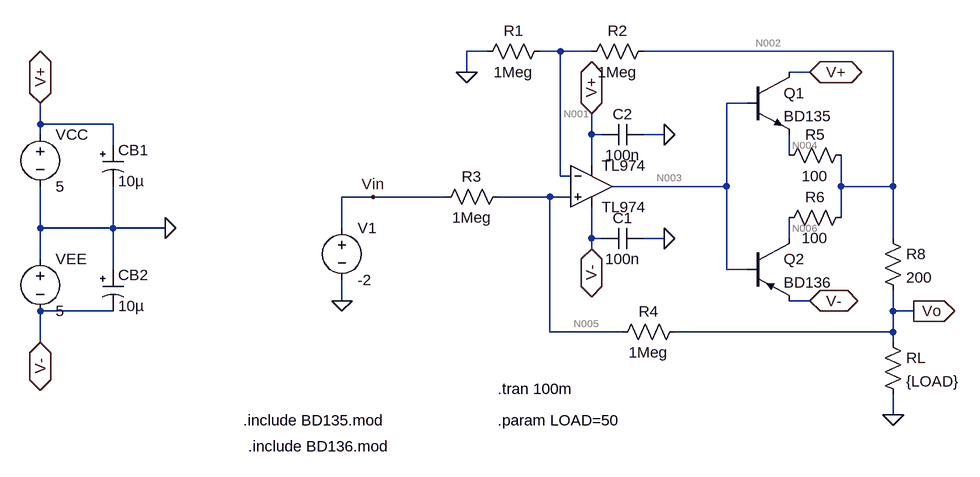
[diagram p0: schematic howlandCurrentPumpBoostedSourceCurrent.asc]
howlandCurrentPumpBoostedSourceCurrent.asc, the LTspice schematic file:
Version 4
SHEET 1 1564 680
WIRE 656 -192 624 -192
WIRE 768 -192 736 -192
WIRE 816 -192 768 -192
WIRE 1280 -192 896 -192
WIRE 624 -160 624 -192
WIRE 1152 -160 1120 -160
WIRE 1056 -112 1024 -112
WIRE -32 -80 -32 -112
WIRE 80 -80 -32 -80
WIRE -32 -64 -32 -80
WIRE 816 -64 816 -96
WIRE 832 -64 816 -64
WIRE 928 -64 896 -64
WIRE 80 -48 80 -80
WIRE 1120 -32 1120 -64
WIRE 816 -16 816 -64
WIRE 768 0 768 -192
WIRE 784 0 768 0
WIRE 1024 16 1024 -112
WIRE 1024 16 848 16
WIRE 1200 16 1200 -32
WIRE 1280 16 1280 -192
WIRE 1280 16 1200 16
WIRE 480 32 432 32
WIRE 592 32 480 32
WIRE 752 32 672 32
WIRE 784 32 752 32
WIRE 1200 64 1200 16
WIRE -32 80 -32 16
WIRE 80 80 80 16
WIRE 80 80 -32 80
WIRE 160 80 80 80
WIRE 432 80 432 32
WIRE 816 96 816 48
WIRE 832 96 816 96
WIRE 928 96 896 96
WIRE 1120 96 1120 64
WIRE 1280 96 1280 16
WIRE 816 112 816 96
WIRE -32 128 -32 80
WIRE 80 144 80 80
WIRE 1024 144 1024 16
WIRE 1056 144 1024 144
WIRE 432 192 432 160
WIRE 1152 192 1120 192
WIRE 80 208 -32 208
WIRE 1280 208 1280 176
WIRE 1312 208 1280 208
WIRE 752 240 752 32
WIRE 864 240 752 240
WIRE 1280 240 1280 208
WIRE 1280 240 944 240
WIRE -32 256 -32 208
WIRE 1280 256 1280 240
WIRE 1280 368 1280 336
FLAG 160 80 0
FLAG -32 -112 V+
IOPIN -32 -112 BiDir
FLAG -32 256 V-
IOPIN -32 256 BiDir
FLAG 928 -64 0
FLAG 928 96 0
FLAG 816 112 V-
IOPIN 816 112 BiDir
FLAG 816 -96 V+
IOPIN 816 -96 BiDir
FLAG 624 -160 0
FLAG 432 192 0
FLAG 480 32 Vin
FLAG 1280 368 0
FLAG 1152 -160 V+
IOPIN 1152 -160 BiDir
FLAG 1152 192 V-
IOPIN 1152 192 BiDir
FLAG 1312 208 Vo
IOPIN 1312 208 Out
SYMBOL voltage -32 -80 R0
WINDOW 123 0 0 Left 0
WINDOW 39 0 0 Left 0
SYMATTR InstName VCC
SYMATTR Value 5
SYMBOL voltage -32 112 R0
SYMATTR InstName VEE
SYMATTR Value 5
SYMBOL TL974 816 16 R0
SYMATTR InstName TL974
SYMBOL res 912 -208 R90
WINDOW 0 0 56 VBottom 2
WINDOW 3 32 56 VTop 2
SYMATTR InstName R2
SYMATTR Value 1Meg
SYMBOL cap 896 80 R90
WINDOW 0 0 32 VBottom 2
WINDOW 3 32 32 VTop 2
SYMATTR InstName C1
SYMATTR Value 100n
SYMBOL cap 896 -80 R90
WINDOW 0 0 32 VBottom 2
WINDOW 3 32 32 VTop 2
SYMATTR InstName C2
SYMATTR Value 100n
SYMBOL polcap 64 -48 R0
SYMATTR InstName CB1
SYMATTR Value 10µ
SYMBOL polcap 64 144 R0
SYMATTR InstName CB2
SYMATTR Value 10µ
SYMBOL res 752 -208 R90
WINDOW 0 0 56 VBottom 2
WINDOW 3 32 56 VTop 2
SYMATTR InstName R1
SYMATTR Value 1Meg
SYMBOL res 960 224 R90
WINDOW 0 0 56 VBottom 2
WINDOW 3 32 56 VTop 2
SYMATTR InstName R4
SYMATTR Value 1Meg
SYMBOL res 688 16 R90
WINDOW 0 0 56 VBottom 2
WINDOW 3 32 56 VTop 2
SYMATTR InstName R3
SYMATTR Value 1Meg
SYMBOL voltage 432 64 R0
SYMATTR InstName V1
SYMATTR Value -2
SYMBOL npn 1056 -160 R0
SYMATTR InstName Q1
SYMATTR Value BD135
SYMBOL pnp 1056 96 R0
SYMATTR InstName Q2
SYMATTR Value BD136
SYMBOL res 1216 -48 R90
WINDOW 0 0 56 VBottom 2
WINDOW 3 32 56 VTop 2
SYMATTR InstName R5
SYMATTR Value 100
SYMBOL res 1216 48 R90
WINDOW 0 0 56 VBottom 2
WINDOW 3 32 56 VTop 2
SYMATTR InstName R6
SYMATTR Value 100
SYMBOL res 1264 240 R0
SYMATTR InstName RL
SYMATTR Value {LOAD}
SYMBOL res 1264 80 R0
SYMATTR InstName R8
SYMATTR Value 200
TEXT 280 376 Left 2 !.include BD135.mod
TEXT 288 416 Left 2 !.include BD136.mod
TEXT 672 328 Left 2 !.tran 100m
TEXT 672 376 Left 2 !.param LOAD=50

The netlist it stands for:
* howlandCurrentPumpBoostedSourceCurrent.asc
VCC V+ 0 5
VEE 0 V- 5
* TL974: TL974 (symbol TL974 not available, pins judged from their places): In+=N005 In-=N001 V+=V+ V-=V- OUT=N003
R2 N002 N001 1Meg
C1 0 V- 100n
C2 0 V+ 100n
CB1 V+ 0 10µ
CB2 0 V- 10µ
R1 N001 0 1Meg
R4 Vo N005 1Meg
R3 N005 Vin 1Meg
V1 Vin 0 -2
Q1 V+ N003 N004 0 BD135
Q2 N006 N003 V- 0 BD136
R5 N002 N004 100
R6 N002 N006 100
RL Vo 0 {LOAD}
R8 N002 Vo 200
.model NPN NPN
.model PNP PNP
.lib standard.bjt
.include BD135.mod
.include BD136.mod
.tran 100m
.param LOAD=50
.backanno
.end

* Results of the author's LTspice run, read from the files saved beside the schematic
* Operating Point, zero values left out:
*   V(v+) = 5 V
*   V(v-) = -5 V
*   V(n005) = -1.143 V
*   V(n001) = -1.141 V
*   V(n003) = -4.093 V
*   V(n002) = -2.482 V
*   V(vo) = -496.4 mV
*   V(vin) = -2 V
*   V(n004) = -2.482 V
*   V(n006) = -3.475 V
*   Ic(Q1) = 5.773 nA
*   Ib(Q1) = -10.81 nA
*   Ie(Q1) = 5.04 nA
*   Ic(Q2) = 9.929 mA
*   Ib(Q2) = -99.64 µA
*   Ie(Q2) = -9.83 mA
*   I(R2) = -1.341 µA
*   I(R1) = -1.141 µA
*   I(R4) = 646.8 nA
*   I(R3) = 856.8 nA
*   I(R5) = 5.04 nA
*   I(R6) = 9.929 mA
*   I(Rl) = -9.929 mA
*   I(R8) = -9.928 mA
*   I(Vcc) = -2 mA
*   I(Vee) = -11.83 mA
*   I(V1) = 856.8 nA
*   Ix(tl974:INP) = -210 nA
*   Ix(tl974:INN) = -200 nA
*   Ix(tl974:VCC) = 2 mA
*   Ix(tl974:VEE) = -2 mA
*   Ix(tl974:OUT) = 99.66 µA